# Altium project digital weighing scale.PrjPcb
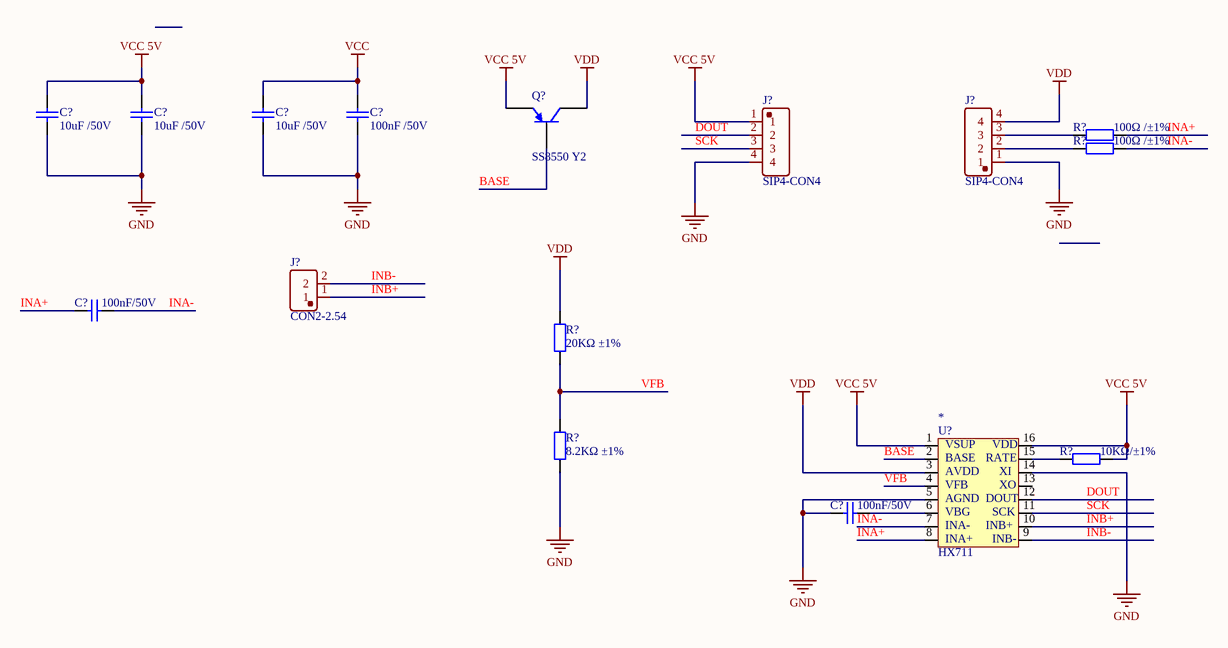
[diagram p0: Sheet1.SchDoc]
1 sheet, 16 parts. Net scope: global (net labels, ports and power ports of the same name join across sheets).

## Sheet Sheet1.SchDoc
size A4; SheetNumber: 1; SheetTotal: 1

### Parts
(Parts that share a designator on the sheet are numbered #1, #2 ... from top to bottom, then left to right.)
*  HX711
C?#1  10uF /50V  [C0402]
C?#2  10uF /50V  [C0402]
C?#3  10uF /50V  [C0402]
C?#4  100nF /50V  [C0402]
C?#5  100nF/50V  [C0402]
C?#6  100nF/50V  [C0402]
J?#1  SIP4-CON4  [DIP-4P-2.54-N]
J?#2  SIP4-CON4  [DIP-4P-2.54-N]
J?#3  CON2-2.54  [DIP-2P-2.54]
Q?  SS8550 Y2  [SOT-23-3]
R?#1  100Ω /±1%  [R1206]
R?#2  100Ω /±1%  [R1206]
R?#3  20KΩ ±1%  [R0805]
R?#4  8.2KΩ ±1%  [R0805]
R?#5  10KΩ/±1%  [R0805]

### Nets
GND: *.5 *.14 C?#1.1 C?#2.1 C?#3.1 C?#4.1 C?#6.1 J?#1.4 J?#2.1 R?#4.1
VCC: C?#3.2 C?#4.2
VCC 5V: *.1 *.16 C?#1.2 C?#2.2 J?#1.1 Q?.2(E) R?#5.2
VDD: *.3 J?#2.4 Q?.3(C) R?#3.2
Net*_6: *.6 C?#6.2
Net*_15: *.15 R?#5.1
NetJ?#2_2: J?#2.2 R?#2.1
NetJ?#2_3: J?#2.3 R?#1.1
NetR?#3_1: R?#3.1 R?#4.2

Not connected (* = marked no-connect by the designer): * 2(6) 4(6) 7(6) 8(6) 9(6) 10(6) 11(6) 12(6) 13(6); C?#5 1 2; J?#1 2 3; J?#3 1 2; Q? 1(B); R?#1 2; R?#2 2

### Notes on the sheet
- (near J?#1) DOUT
- (near J?#1) SCK
- INA+
- INA-
- BASE
- (near C?#5) INA+
- INB+
- INB-
- VFB
- (near *) BASE
- (near R?#5) DOUT
- (near R?#5) SCK
- (near C?#6) INA-
- (near C?#6) INA+
- (in symbol HX711) U?; VSUP; VDD; BASE; RATE; AVDD; XI; VFB; XO; AGND; DOUT; VBG; SCK; INA-; INB+; INA+; INB-

### Library data of the parts
C?#1-C?#4 = 0402 10pF (100) 5% 50V: 贴片电容; ComponentLink1Description: 供应商链接; ComponentLink1URL: http://www.szlcsc.com/product/details_33914.html; Package: 0402; Supplier: LC; SuppliersPartNumber: C32949
C?#5 = 0402 27pF (270) 5% 50V: 贴片电容; ComponentLink1Description: 供应商链接; ComponentLink1URL: http://www.szlcsc.com/product/details_1909.html; Package: 0402; Supplier: LC; SuppliersPartNumber: C1557
C?#6 = 0402 15pF (150) 5% 50V: 贴片电容; ComponentLink1Description: 供应商链接; ComponentLink1URL: http://www.szlcsc.com/product/details_1900.html; Package: 0402; Supplier: LC; SuppliersPartNumber: C1548
Q? = SOT-23 SS8550 Y2: 三极管; ComponentLink1Description: 供应商链接; ComponentLink1URL: http://www.szlcsc.com/product/details_9037.html; Package: SOT-23; Supplier: LC; SuppliersPartNumber: C8542
R?#1 R?#2 = 1206 100Ω (1000) 1%: 贴片电阻; ComponentLink1Description: 供应商链接; ComponentLink1URL: http://www.szlcsc.com/product/details_18589.html; Package: 1206; Supplier: LC; SuppliersPartNumber: C17901
R?#3-R?#5 = 0805 0Ω (0R0) 1%: 贴片电阻; ComponentLink1Description: 供应商链接; ComponentLink1URL: http://www.szlcsc.com/product/details_18165.html; Package: 0805; Supplier: LC; SuppliersPartNumber: C17477